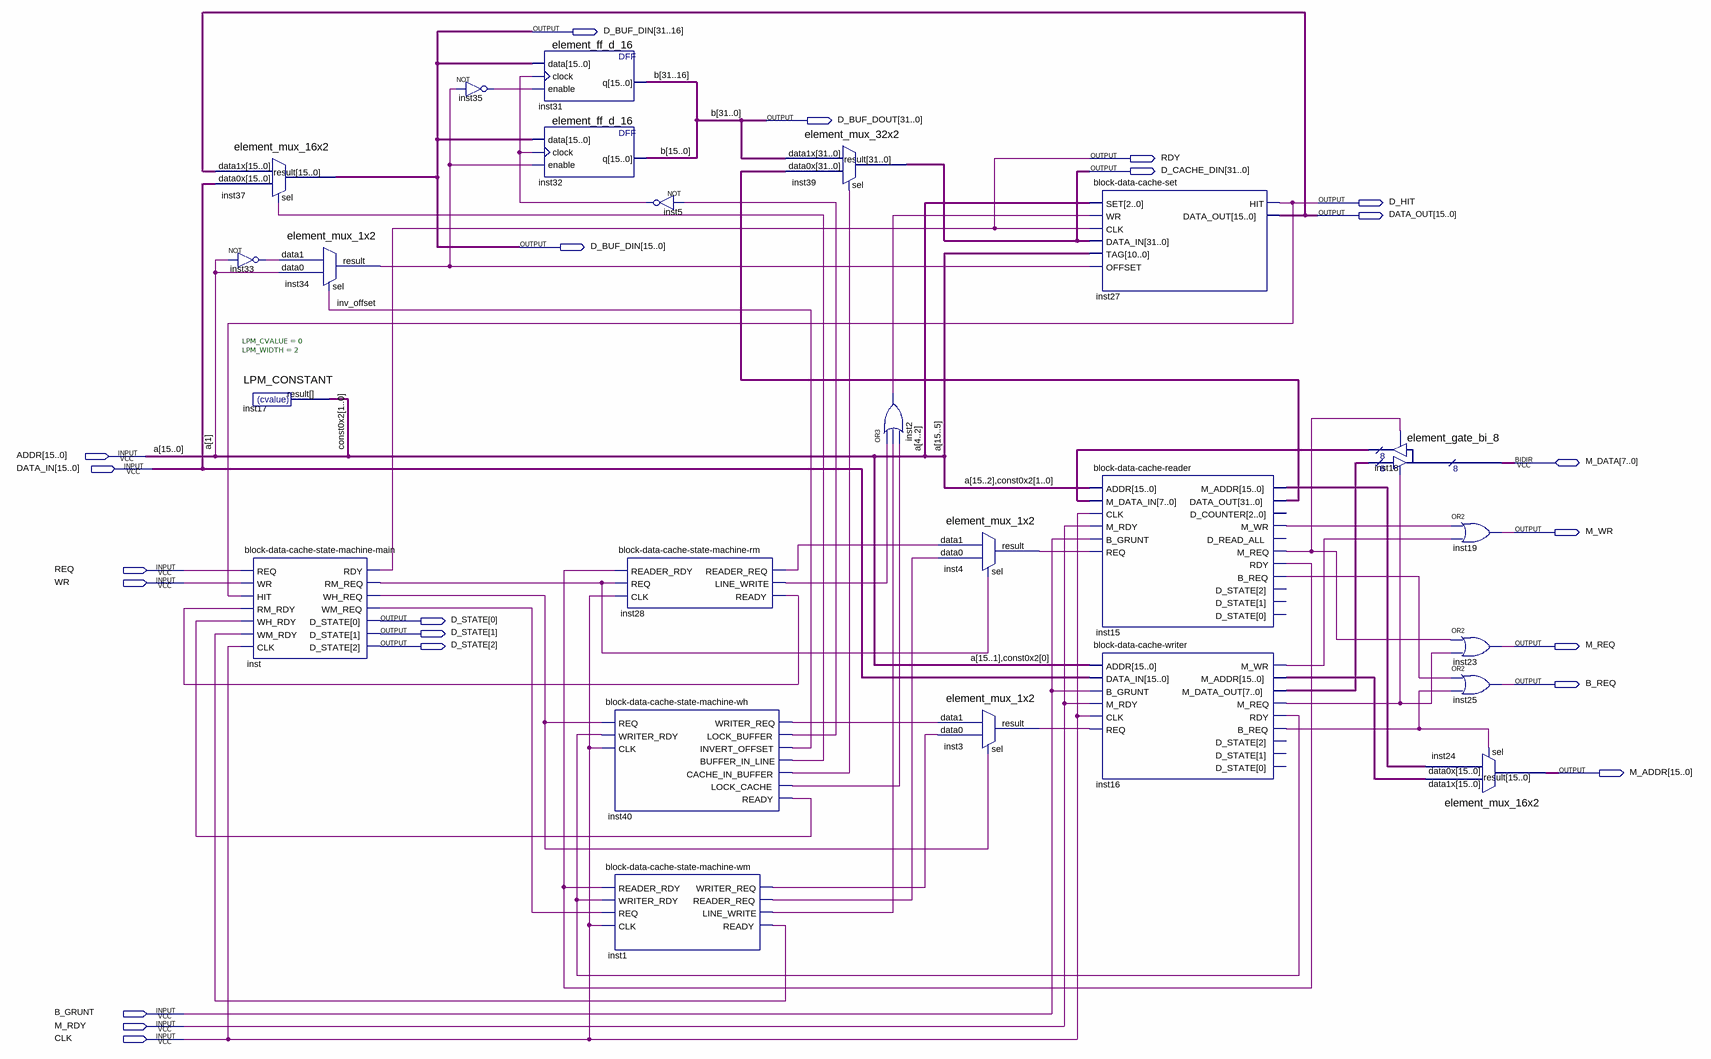
[diagram p0: schematic sheet]
// Quartus schematic block-data-cache.bdf as structural Verilog: 24 symbols, 22 pins
module \block-data-cache  (
  input  [15:0] ADDR,
  input  [15:0] DATA_IN,
  input  REQ,
  input  WR,
  input  B_GRUNT,
  input  M_RDY,
  input  CLK,
  inout  [7:0] M_DATA,
  output [31:0] D_BUF_DIN,
  output [31:0] D_BUF_DOUT,
  output RDY,
  output [31:0] D_CACHE_DIN,
  output D_HIT,
  output [15:0] DATA_OUT,
  output M_WR,
  output [2:0] D_STATE,
  output M_REQ,
  output B_REQ,
  output [15:0] M_ADDR
);

  wire inst1_line_write, inst1_reader_req, inst1_ready, inst1_writer_req, inst2_out, inst3_result,
       inst4_result, inst5_out, inst15_b_req, inst15_m_req, inst15_m_wr, inst15_rdy, inst16_b_req,
       inst16_m_req, inst16_m_wr, inst16_rdy, inst28_line_write, inst28_reader_req, inst28_ready, inst33_out,
       inst34_result, inst35_out, inst40_buffer_in_line, inst40_cache_in_buffer, inst40_lock_buffer,
       inst40_lock_cache, inst40_ready, inst40_writer_req, inst_rm_req, inst_wh_req, inst_wm_req, inv_offset;
  wire [1:0] const0x2;
  wire [7:0] inst16_m_data_out, inst18_result;
  wire [15:0] inst15_m_addr, inst16_m_addr;
  wire [31:0] inst15_data_out;

  element_mux_16x2 inst37 (.data1x(DATA_OUT), .data0x(DATA_IN), .sel(inst40_buffer_in_line), .result(D_BUF_DIN));
  not inst33 (inst33_out, ADDR[1]);
  LPM_CONSTANT #(.LPM_CVALUE(0), .LPM_WIDTH(2)) inst17 (.result(const0x2));
  \block-data-cache-state-machine-main  inst (
    .REQ(REQ), .WR(WR), .HIT(D_HIT), .RM_RDY(inst28_ready), .WH_RDY(inst40_ready), .WM_RDY(inst1_ready),
    .CLK(CLK), .RDY(RDY), .RM_REQ(inst_rm_req), .WH_REQ(inst_wh_req), .WM_REQ(inst_wm_req), .D_STATE(D_STATE));
  element_mux_1x2 inst34 (.data1(inst33_out), .data0(ADDR[1]), .sel(inv_offset), .result(inst34_result));
  not inst35 (inst35_out, inst34_result);
  element_ff_d_16 inst31 (.data(D_BUF_DIN), .clock(inst5_out), .enable(inst35_out), .q(D_BUF_DOUT[31:16]));
  element_ff_d_16 inst32 (.data(D_BUF_DIN), .clock(inst5_out), .enable(inst34_result), .q(D_BUF_DOUT[15:0]));
  \block-data-cache-state-machine-wh  inst40 (
    .REQ(inst_wh_req), .WRITER_RDY(inst16_rdy), .CLK(CLK), .WRITER_REQ(inst40_writer_req),
    .LOCK_BUFFER(inst40_lock_buffer), .INVERT_OFFSET(inv_offset), .BUFFER_IN_LINE(inst40_buffer_in_line),
    .CACHE_IN_BUFFER(inst40_cache_in_buffer), .LOCK_CACHE(inst40_lock_cache), .READY(inst40_ready));
  \block-data-cache-state-machine-wm  inst1 (
    .READER_RDY(inst15_rdy), .WRITER_RDY(inst16_rdy), .REQ(inst_wm_req), .CLK(CLK),
    .WRITER_REQ(inst1_writer_req), .READER_REQ(inst1_reader_req), .LINE_WRITE(inst1_line_write),
    .READY(inst1_ready));
  not inst5 (inst5_out, inst40_lock_buffer);
  \block-data-cache-state-machine-rm  inst28 (
    .READER_RDY(inst15_rdy), .REQ(inst_rm_req), .CLK(CLK), .READER_REQ(inst28_reader_req),
    .LINE_WRITE(inst28_line_write), .READY(inst28_ready));
  element_mux_32x2 inst39 (
    .data1x(D_BUF_DOUT), .data0x(inst15_data_out), .sel(inst40_cache_in_buffer), .result(D_CACHE_DIN));
  or inst2 (inst2_out, inst28_line_write, inst1_line_write, inst40_lock_cache);
  element_mux_1x2 inst4 (.data1(inst28_reader_req), .data0(inst1_reader_req), .sel(inst_rm_req), .result(inst4_result));
  element_mux_1x2 inst3 (.data1(inst40_writer_req), .data0(inst1_writer_req), .sel(inst_wh_req), .result(inst3_result));
  \block-data-cache-set  inst27 (
    .SET(ADDR[4:2]), .WR(inst2_out), .CLK(RDY), .DATA_IN(D_CACHE_DIN), .TAG(ADDR[15:5]),
    .OFFSET(inst34_result), .HIT(D_HIT), .DATA_OUT(DATA_OUT));
  \block-data-cache-reader  inst15 (
    .ADDR({ADDR[15:2], const0x2}), .M_DATA_IN(inst18_result), .CLK(CLK), .M_RDY(M_RDY), .B_GRUNT(B_GRUNT),
    .REQ(inst4_result), .M_ADDR(inst15_m_addr), .DATA_OUT(inst15_data_out), .M_WR(inst15_m_wr),
    .M_REQ(inst15_m_req), .RDY(inst15_rdy), .B_REQ(inst15_b_req));  // open: D_COUNTER, D_READ_ALL, D_STATE
  \block-data-cache-writer  inst16 (
    .ADDR({ADDR[15:1], const0x2[0]}), .DATA_IN(DATA_IN), .B_GRUNT(B_GRUNT), .M_RDY(M_RDY), .CLK(CLK),
    .REQ(inst3_result), .M_WR(inst16_m_wr), .M_ADDR(inst16_m_addr), .M_DATA_OUT(inst16_m_data_out),
    .M_REQ(inst16_m_req), .RDY(inst16_rdy), .B_REQ(inst16_b_req));  // open: D_STATE
  element_gate_bi_8 inst18 (
    .enabledt(inst16_m_req), .data(inst16_m_data_out), .enabletr(inst15_m_req), .result(inst18_result),
    .tridata(M_DATA));
  or inst19 (M_WR, inst15_m_wr, inst16_m_wr);
  or inst23 (M_REQ, inst15_m_req, inst16_m_req);
  or inst25 (B_REQ, inst15_b_req, inst16_b_req);
  element_mux_16x2 inst24 (.data1x(inst16_m_addr), .data0x(inst15_m_addr), .sel(inst16_b_req), .result(M_ADDR));

  // Other names for the same wires on the sheet: a[15:0] = ADDR; b[31:0] = D_BUF_DOUT
endmodule
